# Altium schematic sheet LCD 7inch color.SchDoc
size A4; SheetNumber: 2; SheetTotal: 2
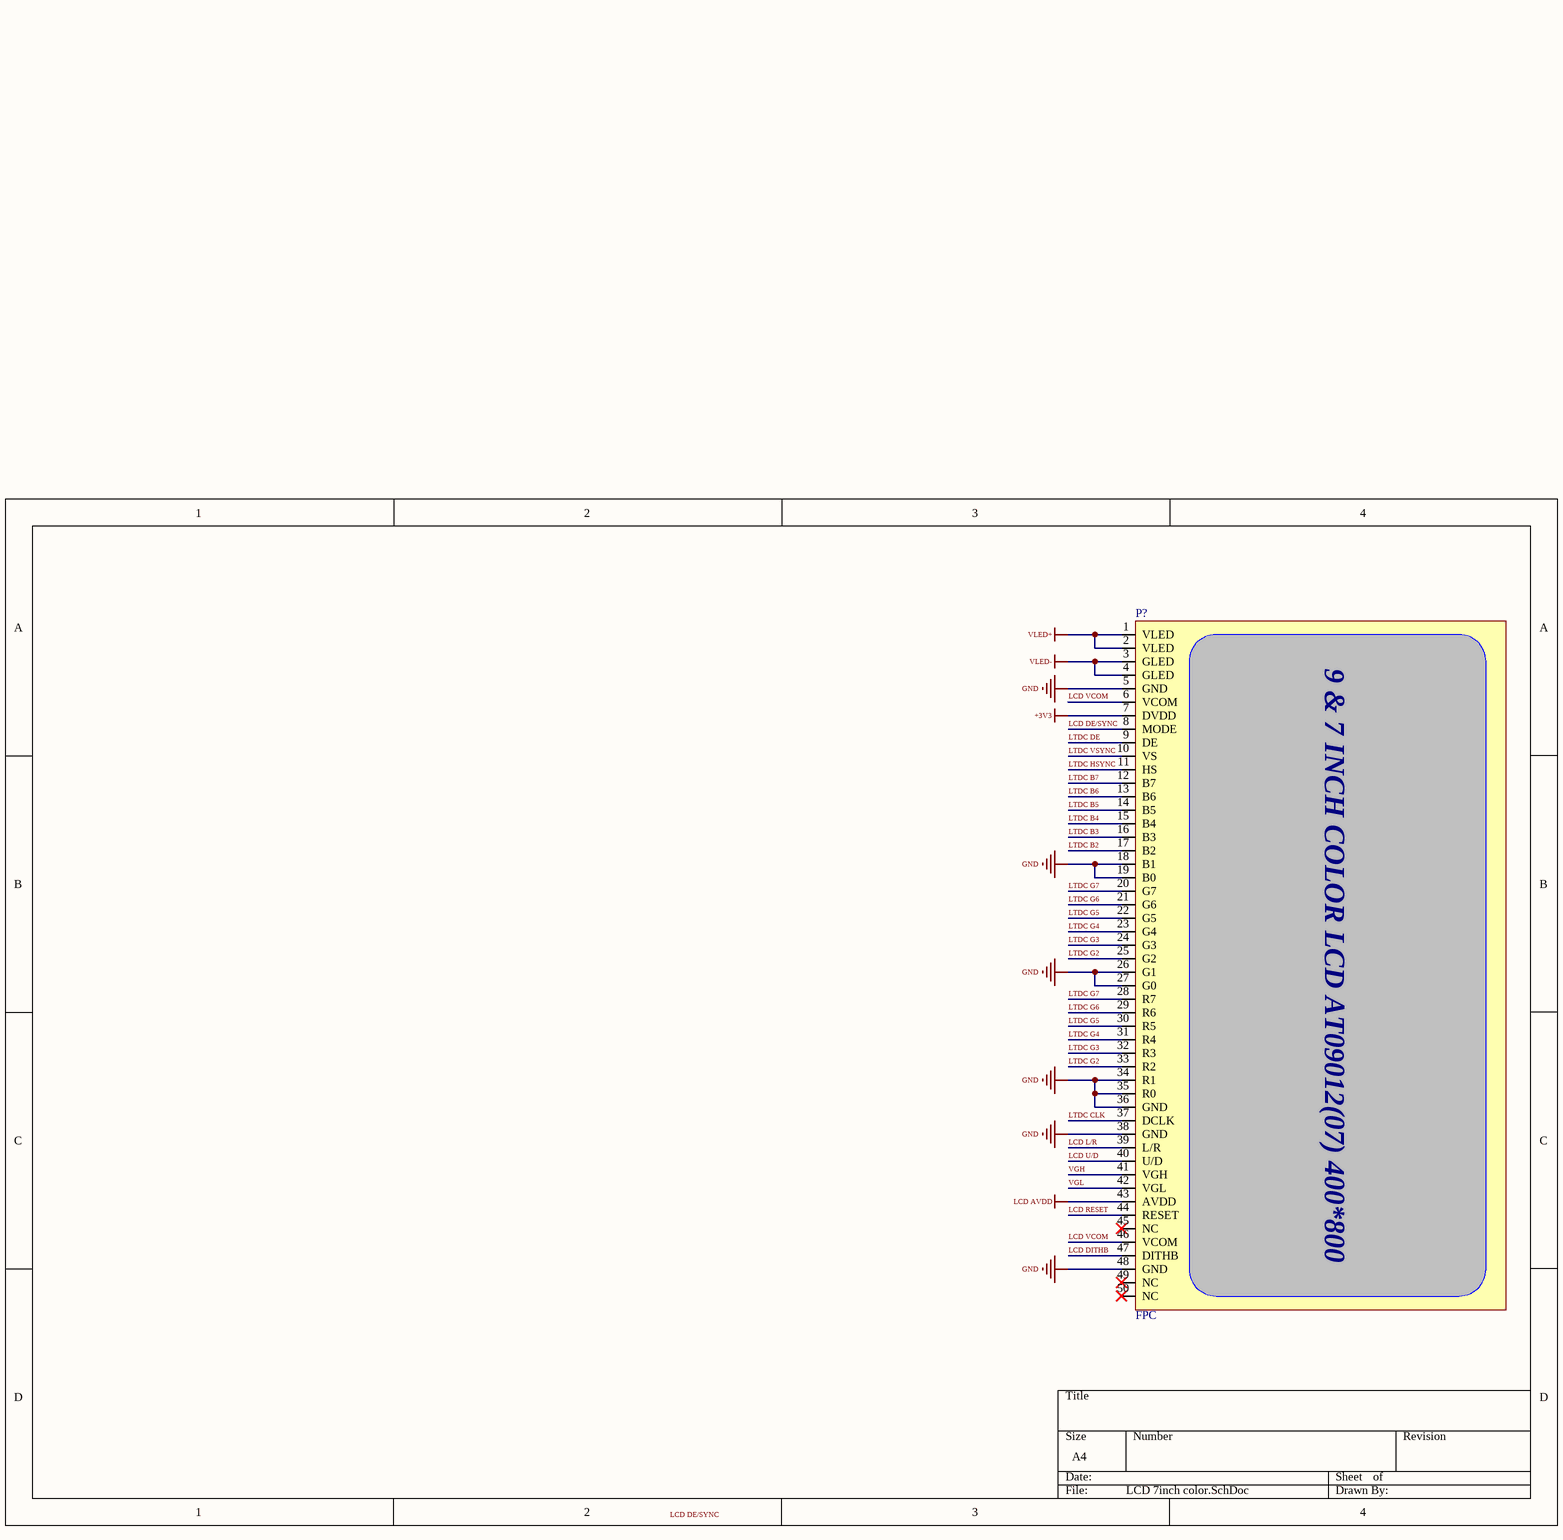
[diagram p0: LCD 7inch color.SchDoc]

## Parts
P?  FPC  [FPC 7]

## Nets
+3V3: P?.7(DVDD)
GND: P?.5(GND) P?.18(B1) P?.19(B0) P?.26(G1) P?.27(G0) P?.34(R1) P?.35(R0) P?.36(GND) P?.38(GND) P?.48(GND)
LCD AVDD: P?.43(AVDD)
VLED+: P?.1(VLED) P?.2(VLED)
VLED-: P?.3(GLED) P?.4(GLED)
LCD DE/SYNC: P?.8(MODE)
LCD DITHB: P?.47(DITHB)
LCD L/R: P?.39(L/R)
LCD RESET: P?.44(RESET)
LCD U/D: P?.40(U/D)
LCD VCOM: P?.6(VCOM) P?.46(VCOM)
LTDC B2: P?.17(B2)
LTDC B3: P?.16(B3)
LTDC B4: P?.15(B4)
LTDC B5: P?.14(B5)
LTDC B6: P?.13(B6)
LTDC B7: P?.12(B7)
LTDC CLK: P?.37(DCLK)
LTDC DE: P?.9(DE)
LTDC G2: P?.25(G2) P?.33(R2)
LTDC G3: P?.24(G3) P?.32(R3)
LTDC G4: P?.23(G4) P?.31(R4)
LTDC G5: P?.22(G5) P?.30(R5)
LTDC G6: P?.21(G6) P?.29(R6)
LTDC G7: P?.20(G7) P?.28(R7)
LTDC HSYNC: P?.11(HS)
LTDC VSYNC: P?.10(VS)
VGH: P?.41(VGH)
VGL: P?.42(VGL)

Not connected (* = marked no-connect by the designer): P? 45(NC)* 49(NC)* 50(NC)*

## Notes on the sheet
- Labels drawn without touching a wire or pin: LCD DE/SYNC
- (in symbol FPC) 9 & 7 INCH COLOR LCD AT09012(07) 400*800